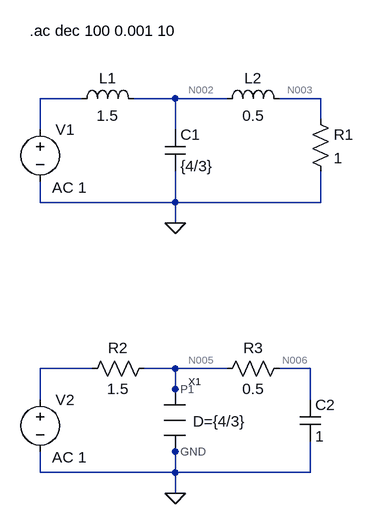
[diagram p0: schematic Draft1.asc]
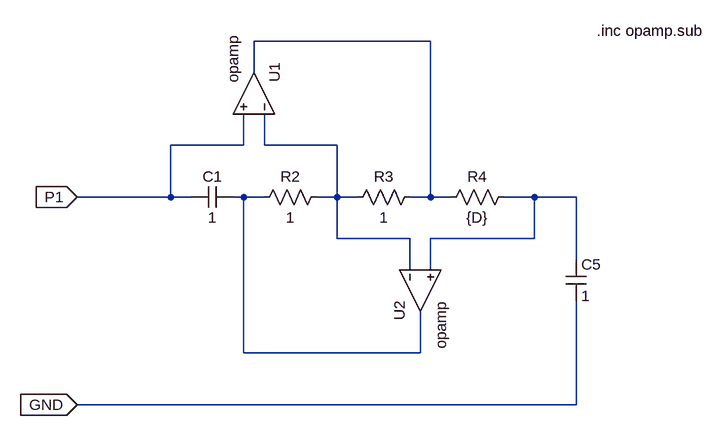
[diagram p1: sub-circuit fdnr.asc]
Draft1.asc, the LTspice schematic file:
Version 4
SHEET 1 880 680
WIRE 112 32 48 32
WIRE 256 32 192 32
WIRE 336 32 256 32
WIRE 480 32 416 32
WIRE 480 64 480 32
WIRE 48 80 48 32
WIRE 256 80 256 32
WIRE 48 192 48 160
WIRE 256 192 256 144
WIRE 256 192 48 192
WIRE 480 192 480 144
WIRE 480 192 256 192
WIRE 256 224 256 192
WIRE 128 448 48 448
WIRE 256 448 208 448
WIRE 336 448 256 448
WIRE 464 448 416 448
WIRE 256 480 256 448
WIRE 48 496 48 448
WIRE 256 496 256 480
WIRE 464 496 464 448
WIRE 256 576 256 560
WIRE 48 608 48 576
WIRE 256 608 256 576
WIRE 256 608 48 608
WIRE 464 608 464 560
WIRE 464 608 256 608
WIRE 256 640 256 608
FLAG 256 224 0
FLAG 256 640 0
SYMBOL ind 96 48 R270
WINDOW 0 32 56 VTop 2
WINDOW 3 5 56 VBottom 2
SYMATTR InstName L1
SYMATTR Value 1.5
SYMBOL ind 320 48 R270
WINDOW 0 32 56 VTop 2
WINDOW 3 5 56 VBottom 2
SYMATTR InstName L2
SYMATTR Value 0.5
SYMBOL cap 240 80 R0
SYMATTR InstName C1
SYMATTR Value {4/3}
SYMBOL res 464 48 R0
SYMATTR InstName R1
SYMATTR Value 1
SYMBOL voltage 48 64 R0
WINDOW 123 18 105 Left 2
WINDOW 39 0 0 Left 0
SYMATTR InstName V1
SYMATTR Value ""
SYMATTR Value2 AC 1
SYMBOL voltage 48 480 R0
WINDOW 123 18 105 Left 2
WINDOW 39 0 0 Left 0
SYMATTR InstName V2
SYMATTR Value ""
SYMATTR Value2 AC 1
SYMBOL res 224 432 R90
WINDOW 0 0 56 VBottom 2
WINDOW 3 32 56 VTop 2
SYMATTR InstName R2
SYMATTR Value 1.5
SYMBOL res 432 432 R90
WINDOW 0 0 56 VBottom 2
WINDOW 3 32 56 VTop 2
SYMATTR InstName R3
SYMATTR Value 0.5
SYMBOL cap 448 496 R0
SYMATTR InstName C2
SYMATTR Value 1
SYMBOL FDNR 256 528 R0
WINDOW 39 27 1 Left 2
SYMATTR InstName X1
SYMATTR SpiceLine D={4/3}
TEXT 32 -72 Left 2 !.ac dec 100 0.001 10

fdnr.asc, the sub-circuit schematic file:
Version 4
SHEET 1 880 680
WIRE 336 -48 64 -48
WIRE 64 0 64 -48
WIRE 48 112 48 64
WIRE 48 112 -64 112
WIRE 80 112 80 64
WIRE 192 112 80 112
WIRE -64 192 -64 112
WIRE -64 192 -208 192
WIRE -32 192 -64 192
WIRE 48 192 32 192
WIRE 80 192 48 192
WIRE 192 192 192 112
WIRE 192 192 160 192
WIRE 224 192 192 192
WIRE 336 192 336 -48
WIRE 336 192 304 192
WIRE 368 192 336 192
WIRE 496 192 448 192
WIRE 560 192 496 192
WIRE 192 256 192 192
WIRE 304 256 192 256
WIRE 496 256 496 192
WIRE 496 256 336 256
WIRE 560 288 560 192
WIRE 304 304 304 256
WIRE 336 304 336 256
WIRE 48 432 48 192
WIRE 320 432 320 368
WIRE 320 432 48 432
WIRE 560 512 560 352
WIRE 560 512 -208 512
FLAG -208 192 P1
IOPIN -208 192 In
FLAG -208 512 GND
IOPIN -208 512 In
SYMBOL Opamps\\opamp 128 32 M270
SYMATTR InstName U1
SYMBOL Opamps\\opamp 256 336 M90
SYMATTR InstName U2
SYMBOL cap 32 176 R90
WINDOW 0 0 32 VBottom 2
WINDOW 3 32 32 VTop 2
SYMATTR InstName C1
SYMATTR Value 1
SYMBOL cap 544 288 R0
SYMATTR InstName C5
SYMATTR Value 1
SYMBOL res 176 176 R90
WINDOW 0 0 56 VBottom 2
WINDOW 3 32 56 VTop 2
SYMATTR InstName R2
SYMATTR Value 1
SYMBOL res 320 176 R90
WINDOW 0 0 56 VBottom 2
WINDOW 3 32 56 VTop 2
SYMATTR InstName R3
SYMATTR Value 1
SYMBOL res 464 176 R90
WINDOW 0 0 56 VBottom 2
WINDOW 3 32 56 VTop 2
SYMATTR InstName R4
SYMATTR Value {D}
TEXT 592 -64 Left 2 !.inc opamp.sub

The netlist it stands for:
* Draft1.asc
L1 N001 N002 1.5
L2 N002 N003 0.5
C1 N002 0 {4/3}
R1 N003 0 1
V1 N001 0 AC 1
V2 N004 0 AC 1
R2 N005 N004 1.5
R3 N006 N005 0.5
C2 N006 0 1
XX1 N005 0 fdnr params: D={4/3}

* block symbol definitions
.subckt fdnr P1 GND
XU1 N002 P1 N001 opamp Aol=100K GBW=10Meg  ; pins invin noninvin out
XU2 N002 N004 N003 opamp Aol=100K GBW=10Meg  ; pins invin noninvin out
C1 N003 P1 1
C5 N004 GND 1
R2 N002 N003 1
R3 N001 N002 1
R4 N004 N001 {D}
.inc opamp.sub
.ends fdnr

.ac dec 100 0.001 10
.backanno
.end

* Results of the author's LTspice run, read from the files saved beside the schematic
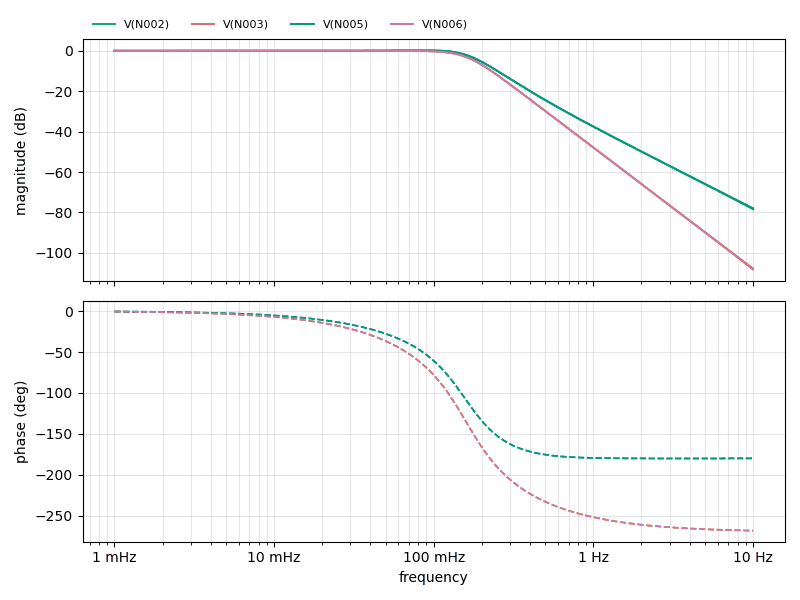
[diagram p2: AC Analysis of Draft1.asc, plotted from the saved traces]
* AC Analysis, 1 run:
*   V(N002): -0.01 dB at 1 mHz, -77.94 dB at 10 Hz, peak 0.20 dB at 85.11 mHz, 3 dB below the peak at 169.3 mHz
*   V(N003): -0.02 dB at 1 mHz, -107.89 dB at 10 Hz, peak -0.02 dB at 35.48 mHz, 3 dB below the peak at 159.2 mHz
*   V(N005): 0.00 dB at 1 mHz, -78.41 dB at 10 Hz, peak 0.20 dB at 85.11 mHz, 3 dB below the peak at 169.3 mHz
*   V(N006): -0.00 dB at 1 mHz, -108.36 dB at 10 Hz, peak -0.00 dB at 1 mHz, 3 dB below the peak at 159.1 mHz